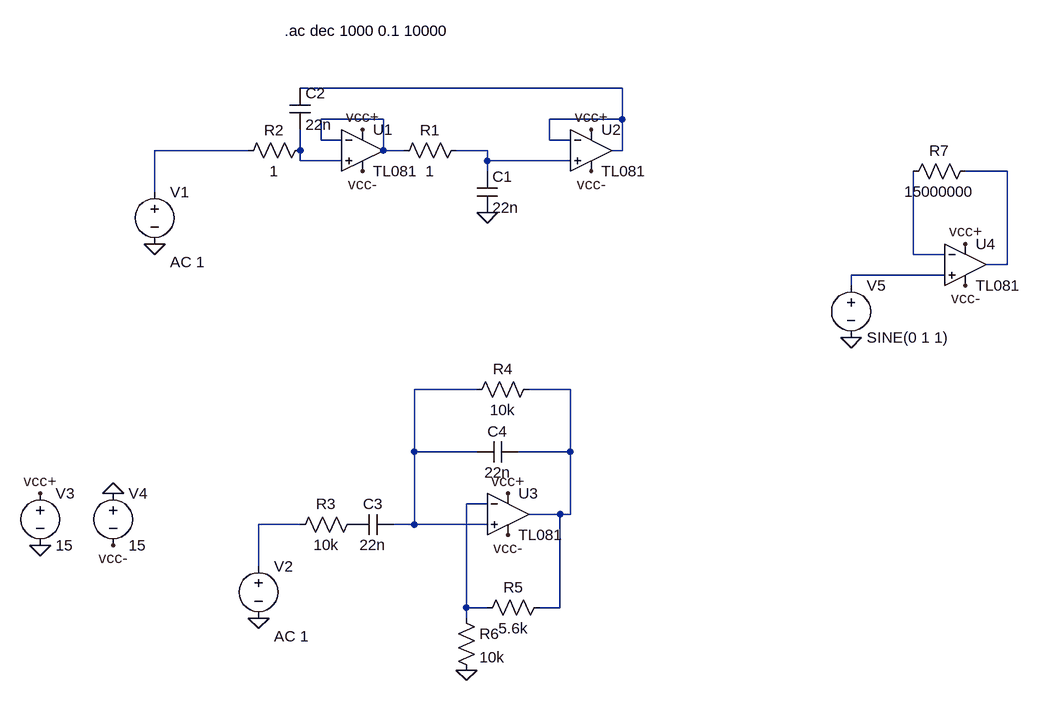
[diagram p0: schematic Draft4.asc]
Draft4.asc, the LTspice schematic file:
Version 4.1
SHEET 1 1028 964
WIRE 432 48 -64 48
WIRE 64 96 -32 96
WIRE 432 96 432 48
WIRE 432 96 320 96
WIRE -32 128 -32 96
WIRE 0 128 -32 128
WIRE 320 128 320 96
WIRE 352 128 320 128
WIRE -144 144 -288 144
WIRE -64 144 -64 112
WIRE 64 144 64 96
WIRE 96 144 64 144
WIRE 224 144 176 144
WIRE 432 144 432 96
WIRE 432 144 416 144
WIRE -64 160 -64 144
WIRE 0 160 -64 160
WIRE 224 160 224 144
WIRE 352 160 224 160
WIRE 224 176 224 160
WIRE 1024 176 960 176
WIRE -288 208 -288 144
WIRE 880 304 880 176
WIRE 928 304 880 304
WIRE 1024 320 1024 176
WIRE 1024 320 992 320
WIRE 928 336 784 336
WIRE 784 352 784 336
WIRE 208 512 112 512
WIRE 352 512 288 512
WIRE 112 608 112 512
WIRE 208 608 112 608
WIRE 352 608 352 512
WIRE 352 608 272 608
WIRE 224 688 192 688
WIRE 336 704 288 704
WIRE 352 704 352 608
WIRE 352 704 336 704
WIRE -64 720 -128 720
WIRE 112 720 112 608
WIRE 112 720 80 720
WIRE 224 720 112 720
WIRE -128 784 -128 720
WIRE 192 848 192 688
WIRE 224 848 192 848
WIRE 336 848 336 704
WIRE 336 848 304 848
WIRE 192 864 192 848
FLAG -288 288 0
FLAG 224 240 0
FLAG 192 944 0
FLAG -128 864 0
FLAG -352 672 0
FLAG -464 752 0
FLAG -464 672 vcc+
FLAG -352 752 vcc-
FLAG 256 736 vcc-
FLAG 256 672 vcc+
FLAG 32 112 vcc+
FLAG 384 112 vcc+
FLAG 32 176 vcc-
FLAG 384 176 vcc-
FLAG 960 288 vcc+
FLAG 960 352 vcc-
FLAG 784 432 0
SYMBOL OpAmps\\TL081 32 144 R0
SYMATTR InstName U1
SYMBOL OpAmps\\TL081 384 144 R0
SYMATTR InstName U2
SYMBOL cap 208 176 R0
SYMATTR InstName C1
SYMATTR Value 22n
SYMBOL voltage -288 192 R0
WINDOW 123 24 124 Left 2
WINDOW 39 0 0 Left 0
SYMATTR InstName V1
SYMATTR Value ""
SYMATTR Value2 AC 1
SYMBOL res -48 128 R90
WINDOW 0 0 56 VBottom 2
WINDOW 3 32 56 VTop 2
SYMATTR InstName R2
SYMATTR Value 1
SYMBOL cap -80 48 R0
SYMATTR InstName C2
SYMATTR Value 22n
SYMBOL res 192 128 R90
WINDOW 0 0 56 VBottom 2
WINDOW 3 32 56 VTop 2
SYMATTR InstName R1
SYMATTR Value 1
SYMBOL voltage -128 768 R0
WINDOW 123 24 124 Left 2
WINDOW 39 0 0 Left 0
SYMATTR InstName V2
SYMATTR Value ""
SYMATTR Value2 AC 1
SYMBOL res 32 704 R90
WINDOW 0 0 56 VBottom 2
WINDOW 3 32 56 VTop 2
SYMATTR InstName R3
SYMATTR Value 10k
SYMBOL cap 80 704 R90
WINDOW 0 0 32 VBottom 2
WINDOW 3 32 32 VTop 2
SYMATTR InstName C3
SYMATTR Value 22n
SYMBOL OpAmps\\TL081 256 704 R0
SYMATTR InstName U3
SYMBOL cap 272 592 R90
WINDOW 0 0 32 VBottom 2
WINDOW 3 32 32 VTop 2
SYMATTR InstName C4
SYMATTR Value 22n
SYMBOL res 304 496 R90
WINDOW 0 0 56 VBottom 2
WINDOW 3 32 56 VTop 2
SYMATTR InstName R4
SYMATTR Value 10k
SYMBOL res 320 832 R90
WINDOW 0 0 56 VBottom 2
WINDOW 3 32 56 VTop 2
SYMATTR InstName R5
SYMATTR Value 5.6k
SYMBOL res 176 848 R0
SYMATTR InstName R6
SYMATTR Value 10k
SYMBOL voltage -464 656 R0
WINDOW 123 0 0 Left 0
WINDOW 39 0 0 Left 0
SYMATTR InstName V3
SYMATTR Value 15
SYMBOL voltage -352 656 R0
WINDOW 123 0 0 Left 0
WINDOW 39 0 0 Left 0
SYMATTR InstName V4
SYMATTR Value 15
SYMBOL OpAmps\\TL081 960 320 R0
SYMATTR InstName U4
SYMBOL voltage 784 336 R0
WINDOW 123 0 0 Left 0
WINDOW 39 0 0 Left 0
SYMATTR InstName V5
SYMATTR Value SINE(0 1 1)
SYMBOL res 976 160 R90
WINDOW 0 0 56 VBottom 2
WINDOW 3 32 56 VTop 2
SYMATTR InstName R7
SYMATTR Value 15000000
TEXT -88 -40 Left 2 !.ac dec 1000 0.1 10000

The netlist it stands for:
* Draft4.asc
* U1: TL081 (symbol OpAmps\TL081 not available, pins judged from their places): In+=N004 In-=N002 V+=vcc+ V-=vcc- OUT=N002
* U2: TL081 (symbol OpAmps\TL081 not available, pins judged from their places): In+=N005 In-=N001 V+=vcc+ V-=vcc- OUT=N001
C1 N005 0 22n
V1 N003 0 AC 1
R2 N004 N003 1
C2 N001 N004 22n
R1 N005 N002 1
V2 N012 0 AC 1
R3 P001 N012 10k
C3 N009 P001 22n
* U3: TL081 (symbol OpAmps\TL081 not available, pins judged from their places): In+=N009 In-=N011 V+=vcc+ V-=vcc- OUT=N010
C4 N010 N009 22n
R4 N010 N009 10k
R5 N010 N011 5.6k
R6 N011 0 10k
V3 vcc+ 0 15
V4 0 vcc- 15
* U4: TL081 (symbol OpAmps\TL081 not available, pins judged from their places): In+=N008 In-=N007 V+=vcc+ V-=vcc- OUT=N006
V5 N008 0 SINE(0 1 1)
R7 N006 N007 15000000
.ac dec 1000 0.1 10000
.backanno
.end